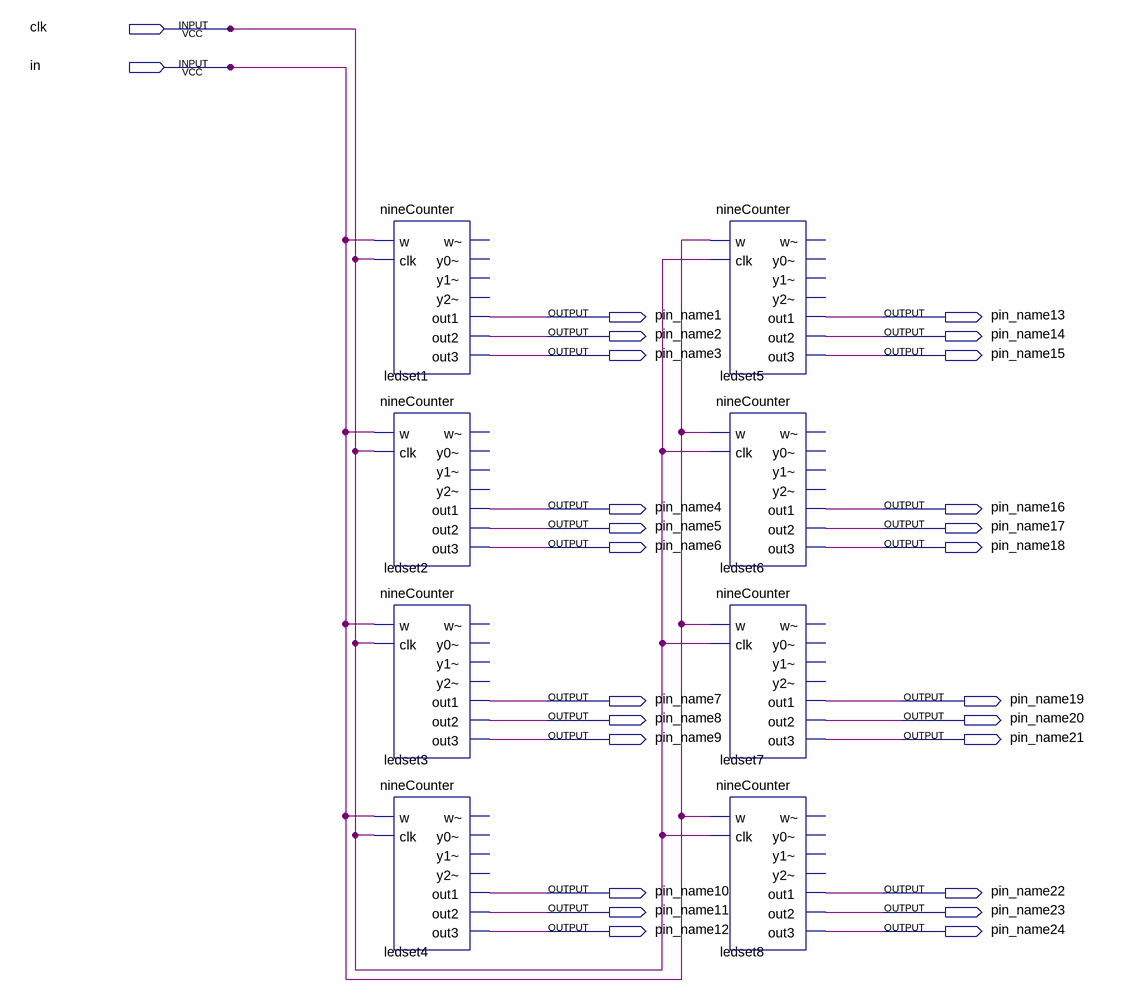
[diagram p0: schematic sheet]
// Quartus schematic ledPatternGen.bdf as structural Verilog: 8 symbols, 26 pins
module ledPatternGen (
  input  clk,
  input  in,
  output pin_name1,
  output pin_name13,
  output pin_name2,
  output pin_name14,
  output pin_name3,
  output pin_name15,
  output pin_name4,
  output pin_name16,
  output pin_name5,
  output pin_name17,
  output pin_name6,
  output pin_name18,
  output pin_name7,
  output pin_name19,
  output pin_name8,
  output pin_name20,
  output pin_name9,
  output pin_name21,
  output pin_name10,
  output pin_name22,
  output pin_name11,
  output pin_name23,
  output pin_name12,
  output pin_name24
);

  nineCounter ledset1 (
    .w(in), .clk(clk), .out1(pin_name1), .out2(pin_name2), .out3(pin_name3));  // open: w~, y0~, y1~, y2~
  nineCounter ledset2 (
    .w(in), .clk(clk), .out1(pin_name4), .out2(pin_name5), .out3(pin_name6));  // open: w~, y0~, y1~, y2~
  nineCounter ledset3 (
    .w(in), .clk(clk), .out1(pin_name7), .out2(pin_name8), .out3(pin_name9));  // open: w~, y0~, y1~, y2~
  nineCounter ledset4 (
    .w(in), .clk(clk), .out1(pin_name10), .out2(pin_name11), .out3(pin_name12));  // open: w~, y0~, y1~, y2~
  nineCounter ledset5 (
    .w(in), .clk(clk), .out1(pin_name13), .out2(pin_name14), .out3(pin_name15));  // open: w~, y0~, y1~, y2~
  nineCounter ledset6 (
    .w(in), .clk(clk), .out1(pin_name16), .out2(pin_name17), .out3(pin_name18));  // open: w~, y0~, y1~, y2~
  nineCounter ledset7 (
    .w(in), .clk(clk), .out1(pin_name19), .out2(pin_name20), .out3(pin_name21));  // open: w~, y0~, y1~, y2~
  nineCounter ledset8 (
    .w(in), .clk(clk), .out1(pin_name22), .out2(pin_name23), .out3(pin_name24));  // open: w~, y0~, y1~, y2~
endmodule
